# EAGLE design THAT-breakouts (EAGLE 7.5.0)
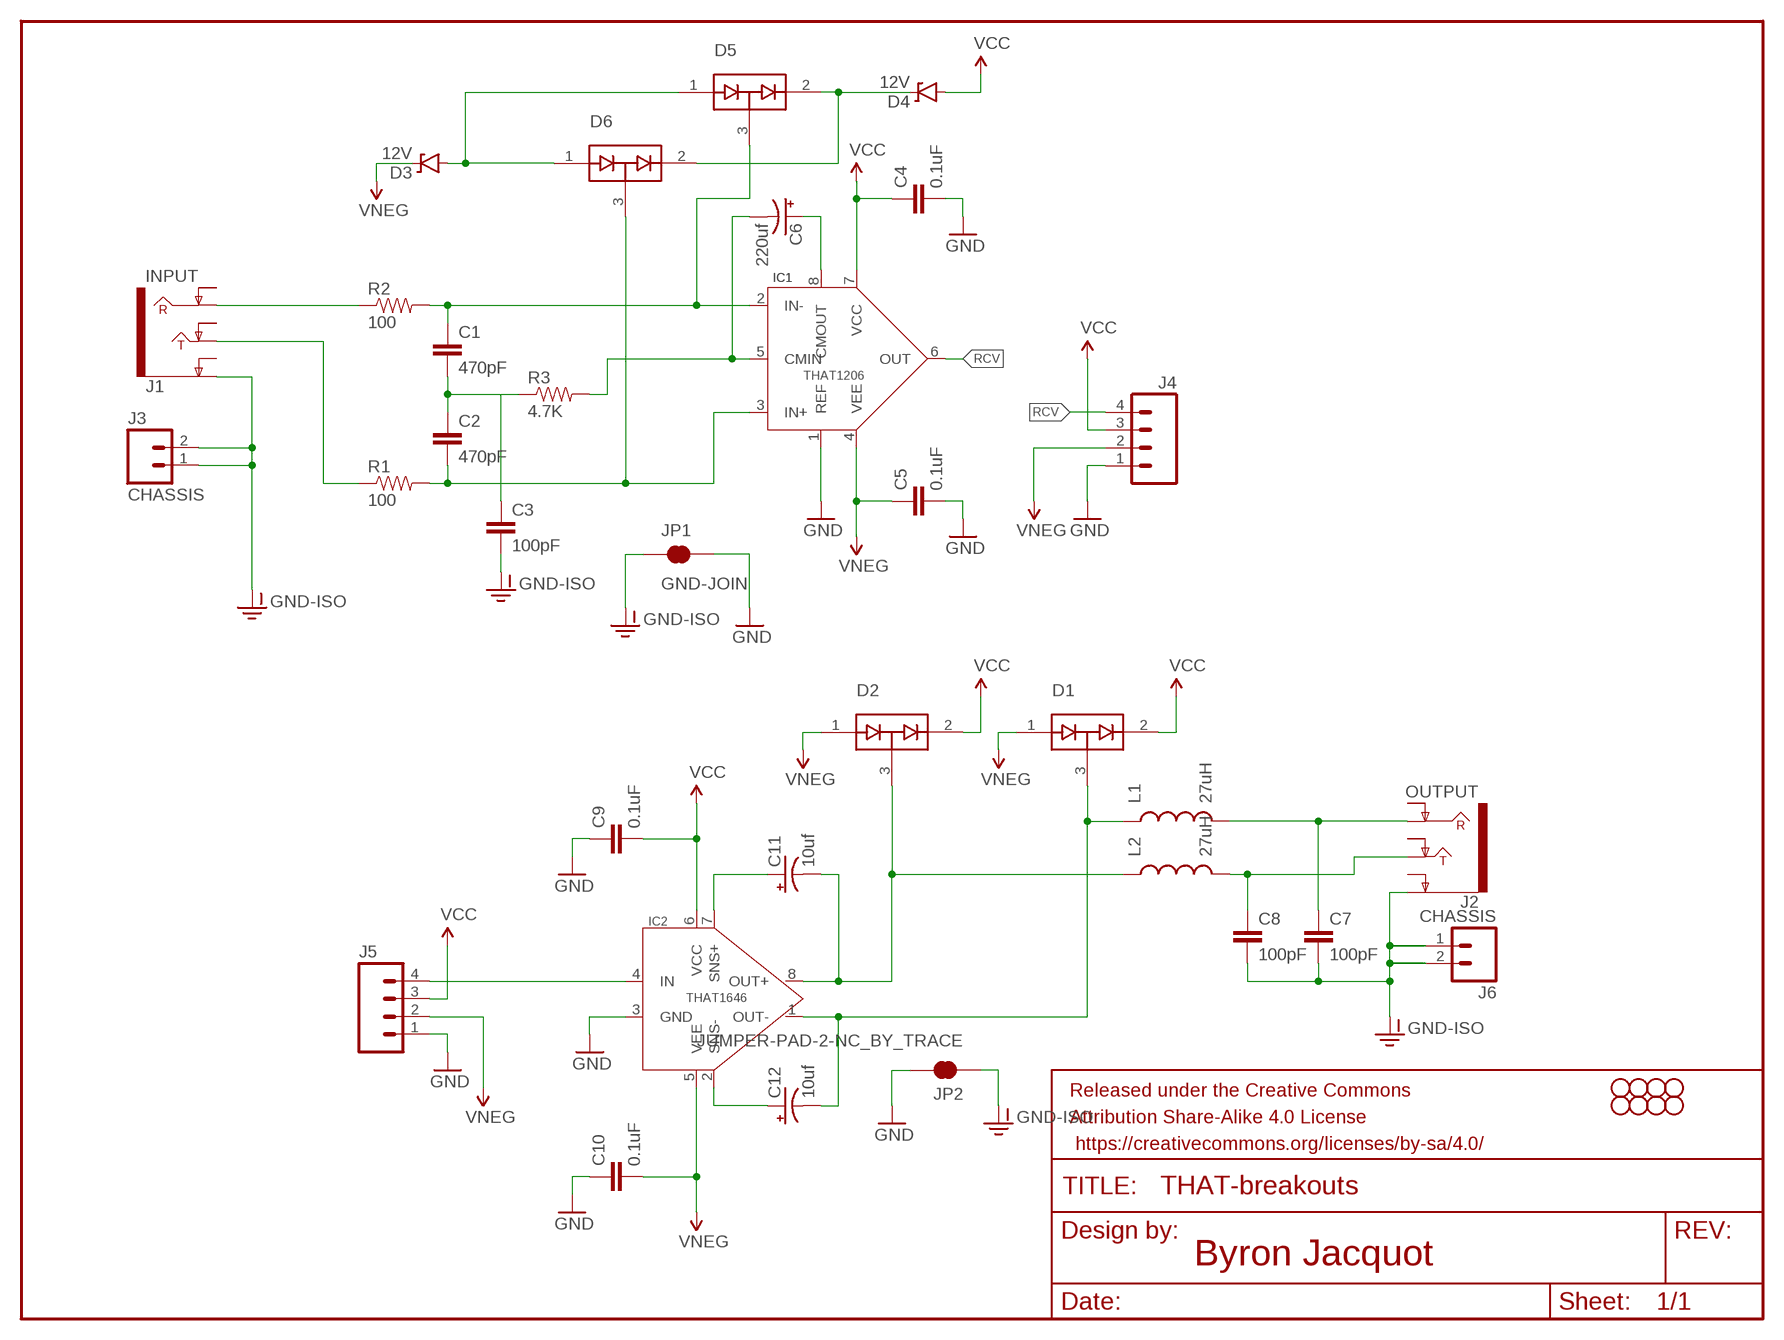
[diagram p0: schematic, sheet 1]

## Parts
C1  470pF  470PF-50V-5%(0603)SMD  [0603-CAP]
C2  470pF  470PF-50V-5%(0603)SMD  [0603-CAP]
C3  100pF  100PF-50V-5%(0603)  [0603-CAP]
C4  0.1uF  0.1UF-25V-5%(0603)  [0603-CAP]
C5  0.1uF  0.1UF-25V-5%(0603)  [0603-CAP]
C6  220uf  PANA-EEE-FKOJ221P  [PANASONIC_D]
C7  100pF  100PF-50V-5%(0603)  [0603-CAP]
C8  100pF  100PF-50V-5%(0603)  [0603-CAP]
C9  0.1uF  0.1UF-25V-5%(0603)  [0603-CAP]
C10  0.1uF  0.1UF-25V-5%(0603)  [0603-CAP]
C11  10uf  PANA-EEE-1EA100NP  [PANASONIC_D]
C12  10uf  PANA-EEE-1EA100NP  [PANASONIC_D]
D1  BAV99  [SOT23-3]
D2  BAV99  [SOT23-3]
D3  12V  12V-ZENER-DIODE  [SOD-323]
D4  12V  12V-ZENER-DIODE  [SOD-323]
D5  BAV99  [SOT23-3]
D6  BAV99  [SOT23-3]
FRAME1  FRAME-LETTER  [CREATIVE_COMMONS]
H1  STAND-OFF  [STAND-OFF]
H2  STAND-OFF  [STAND-OFF]
H3  STAND-OFF  [STAND-OFF]
H4  STAND-OFF  [STAND-OFF]
H5  STAND-OFF  [STAND-OFF]
H6  STAND-OFF  [STAND-OFF]
H7  STAND-OFF  [STAND-OFF]
H8  STAND-OFF  [STAND-OFF]
IC1  THAT1206  [SO08]
IC2  THAT1646  [SO08]
J1  INPUT  AUDIO-JACK4-.25-HORIZ-TRS  [AUDIO-JACK-.25-INCH-HORIZ-PTH]
J2  OUTPUT  AUDIO-JACK4-.25-HORIZ-TRS  [AUDIO-JACK-.25-INCH-HORIZ-PTH]
J3  CHASSIS  M021X02_NO_SILK  [1X02_NO_SILK]
J4  M04NO_SILK_ALL_ROUND  [1X04_NO_SILK_ALL_ROUND]
J5  M04NO_SILK_ALL_ROUND  [1X04_NO_SILK_ALL_ROUND]
J6  CHASSIS  M021X02_NO_SILK  [1X02_NO_SILK]
JP1  GND-JOIN  JUMPER-PAD-2-NC_BY_TRACE  [PAD-JUMPER-2-NC_BY_TRACE_YES_SILK]
JP2  JUMPER-PAD-2-NC_BY_TRACE  [PAD-JUMPER-2-NC_BY_TRACE_YES_SILK]
L1  27uH  INDUCTOR0603  [0603]
L2  27uH  INDUCTOR0603  [0603]
R1  100  100OHM-1/10W-1%(0603)  [0603-RES]
R2  100  100OHM-1/10W-1%(0603)  [0603-RES]
R3  4.7K  4.7KOHM-1/10W-1%(0603)  [0603-RES]

## Nets
GND: C4.2 C5.2 C9.1 C10.1 IC1.1(REF) IC2.3(GND) J4.1 J5.1 JP1.2 JP2.2
GND-ISO: C3.2 C7.2 C8.2 J1.SLEEVE(EARTH) J2.SLEEVE(EARTH) J3.1 J3.2 J6.1 J6.2 JP1.1 JP2.1
N$1: J1.RING R2.1
N$2: C1.1 D5.3(COM) IC1.2(IN-) R2.2
N$3: J1.TIP R1.1
N$4: C2.2 D6.3(COM) IC1.3(IN+) R1.2
N$5: C1.2 C2.1 C3.1 R3.1
N$6: C6.- IC1.5(CMIN) R3.2
N$7: C6.+ IC1.8(CMOUT)
N$8: C8.1 J2.TIP L2.2
N$9: C7.1 J2.RING L1.2
N$10: C11.- D2.3(COM) IC2.8(OUT+) L2.1
N$11: C12.- D1.3(COM) IC2.1(OUT-) L1.1
N$12: D3.A D5.1(A1) D6.1(A1)
N$13: C12.+ IC2.2(SNS-)
N$14: C11.+ IC2.7(SNS+)
N$15: D4.C D5.2(C2) D6.2(C2)
N$16: IC2.4(IN) J5.4
RCV: IC1.6(OUT) J4.4
VCC: C4.1 C9.2 D1.2(C2) D2.2(C2) D4.A IC1.7(VCC) IC2.6(VCC) J4.3 J5.3
VNEG: C5.1 C10.2 D1.1(A1) D2.1(A1) D3.C IC1.4(VEE) IC2.5(VEE) J4.2 J5.2
Unconnected: J1.RING-NORM J1.SLEEVE-NORM(EARTH-NORM) J1.TIP-NORM J2.RING-NORM J2.SLEEVE-NORM(EARTH-NORM) J2.TIP-NORM

## Notes on the sheet
- Byron Jacquot

## Library data of the parts
C1 C2 = SparkFun-Capacitors:470PF-50V-5%(0603): CAP-07884; PROD_ID: CAP-07884
C3 C7 C8 = SparkFun-Capacitors:100PF-50V-5%(0603): CAP-07883; PROD_ID: CAP-07883
C4 C5 C9 C10 = SparkFun-Capacitors:0.1UF-25V-5%(0603): CAP-08604; PROD_ID: CAP-08604
C6 = that-ics:PANA-EEE-FKOJ221P: 220 uF 6.3 V cap. Panasonic EEE-FK0J221P digikey PCE3766TR-ND
C11 C12 = that-ics:PANA-EEE-1EA100NP: Panasonic 10uf 25V nonpolar. Panasonic EEE-1EA100NP Digikey PCE4294TR-ND
D1 D2 D5 D6 = SparkFun-DiscreteSemi:BAV99: Two small signal silicon diodes connected anode to cathode. Connections to all three nodes available. DIO-10647; PROD_ID: DIO-10647
D3 D4 = that-ics:12V-ZENER-DIODE; DK_PN: MM3Z12VT1GOSCT-ND; MFR: ON Semi; MFR_PN: MM3Z12VT1G
FRAME1 = SparkFun-Aesthetics:FRAME-LETTER: Schematic Frame Standard 8.5x11 US Letter frame
H1-H8 = SparkFun-Electromechanical:STAND-OFF: #4 Stand Off This is the mechanical footprint for a #4 phillips button head screw. Use the keepout ring to avoid running the screw head into surrounding components. SKU : PRT-00447
IC1 = that-ics:THAT1206: THAT Corporation 1206 InGenius series balanced line receiver.
IC2 = that-ics:THAT1646: THAT Corporation 1646 OutSmarts Balanced line driver
J1 J2 = SparkFun-Connectors:AUDIO-JACK4-.25-HORIZ-TRS: 1/4" TRS jack, horizontal Production SKU: COM-11144 Footprint unproven - datasheet and part seem to be slightly different; PROD_ID: CONN-12339; SF_ID: COM-11144
J3 J6 = SparkFun-Connectors:M02: Standard 2-pin 0.1" header. Use with - straight break away headers ( PRT-00116) - right angle break away headers (PRT-00553) - swiss pins (PRT-00743) - machine pins (PRT-00117) - female headers (PRT-00115) Molex polarized connector foot print use with: PRT-08233 with associated crimp pins and housings. 2.54_SCREWTERM for use with PRT-10571. 3.5mm Screw Terminal footprints for PRT-08084 5mm Screw Terminal footprints for use with PRT-08432
J4 J5 = SparkFun-Connectors:M04: Header 4 Standard 4-pin 0.1" header. Use with straight break away headers (SKU : PRT-00116), right angle break away headers (PRT-00553), swiss pins (PRT-00743), machine pins (PRT-00117), and female headers (PRT-00115). Molex polarized connector foot print use with SKU : PRT-08231 with associated crimp pins and housings. 1MM SMD Version SKU: PRT-10208; PROD_ID: CONN-09696
JP1 JP2 = SparkFun-Passives:JUMPER-PAD-2-NC_BY_TRACE
L1 L2 = SparkFun-Passives:INDUCTOR: Inductors Basic Inductor/Choke - 0603 and 1206. Footprints are not proven and vary greatly between part numbers. INDUCTOR POWER 3.3UH 4.0A SMD 0.197" L x 0.197" W x 0.177" H (5.00mm x 5.00mm x 4.50mm)
R1 R2 = SparkFun-Resistors:100OHM-1/10W-1%(0603): RES-07863; PROD_ID: RES-07863
R3 = SparkFun-Resistors:4.7KOHM-1/10W-1%(0603): RES-07857; PROD_ID: RES-07857

## Board
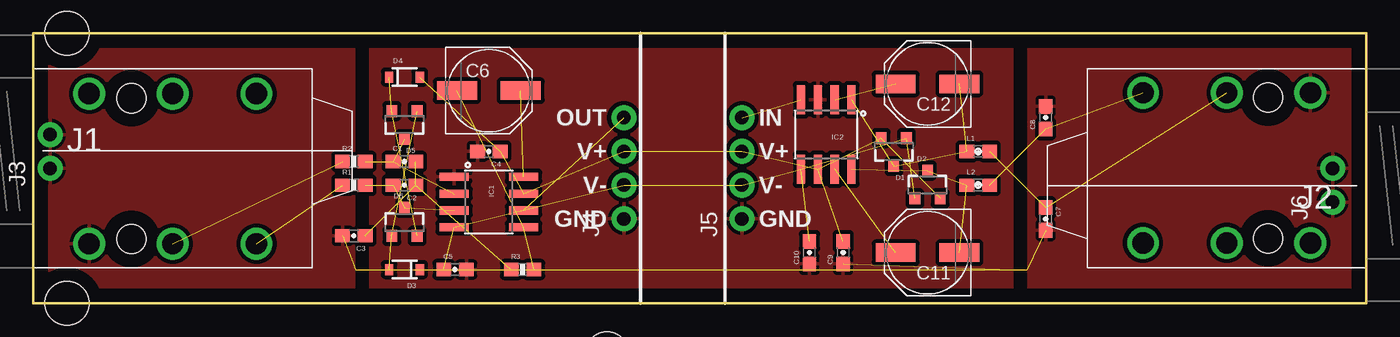
[diagram p1: board, top side]
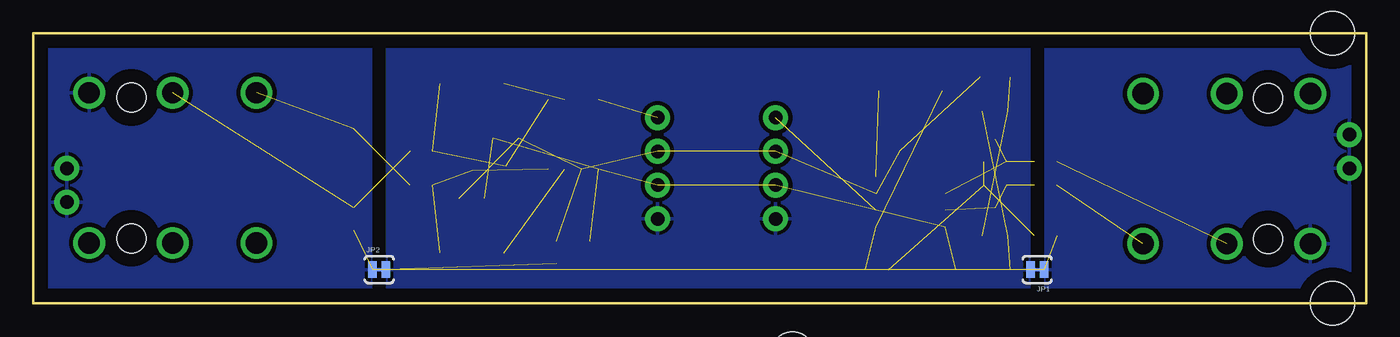
[diagram p2: board, bottom side, seen from below]

Size 100.33 x 20.32 mm. Coordinates in mm from the lower left corner, seen from the top.
Outline: 0,0 100.33,0 100.33,20.32 0,20.32 0,0
Copper layers (1*16): Top 0.035mm / dielectric 1.5mm / Bottom 0.035mm
Design rules "default": minimum track width 10mil, minimum drill 24mil, track to track 8mil, track to pad 8mil, pad to pad 8mil, via to via 8mil, smd to smd 8mil, copper to edge 40mil, drill to drill 8mil, minimum pad ring 10mil, minimum via ring 8mil, stop-mask expansion 4mil, vias tented up to drill 0mil, thermal gap 10mil

### Footprints (pad centres in the part's own frame; a part is rotated, then mirrored left to right if it is on the bottom)
0603-CAP = smd 1.1 x 1: 1 -0.85,0; 2 0.85,0
PANASONIC_D = smd 3 x 1.4: + 2.4,0; - -2.4,0
SOT23-3 = smd 0.8 x 0.9: 1 -0.95,-1; 2 0.95,-1; 3 0,1.1
SOD-323 = smd 0.63 x 0.83: A 1.15,0; C -1.15,0
STAND-OFF = hole 3.302: 0,0
SO08 = smd 0.61 x 2.21: 1 -1.905,-2.616; 2 -0.635,-2.616; 3 0.635,-2.616; 4 1.905,-2.616; 5 1.905,2.616; 6 0.635,2.616; 7 -0.635,2.616; 8 -1.905,2.616
AUDIO-JACK-.25-INCH-HORIZ-PTH = drill 1.6: RING 10.5,-6.95; RING-NORM 10.5,4.35; SLEEVE 4.2,-6.95; SLEEVE-NORM 4.2,4.35; TIP 16.8,-6.95; TIP-NORM 16.8,4.35 | hole 2.2: 7.4,4; 7.4,-6.6
1X02_NO_SILK = drill 1.016 pad 1.88: 1 0,0; 2 2.54,0
1X04_NO_SILK_ALL_ROUND = drill 1.016 pad 1.88: 1 0,0; 2 2.54,0; 3 5.08,0; 4 7.62,0
PAD-JUMPER-2-NC_BY_TRACE_YES_SILK = smd 0.635 x 1.27: 1 -0.508,0; 2 0.508,0
0603 = smd 1.1 x 1: 1 -0.85,0; 2 0.85,0
0603-RES = smd 1.1 x 1: 1 -0.85,0; 2 0.85,0

### Placement (x,y rotation side)
C1  27.94,10.67 0 top
C2  27.94,8.89 180 top
C3  24.13,5.08 180 top
C4  34.29,11.43 180 top
C5  31.75,2.54 0 top
C6  34.29,16 0 top
C7  76.2,6.35 270 top
C8  76.2,13.97 90 top
C9  60.96,3.81 90 top
C10  58.42,3.81 90 top
C11  67.31,3.81 180 top
C12  67.31,16.51 180 top
D1  64.77,11.43 180 top
D2  67.31,8.89 0 top
D3  27.94,2.54 180 top
D4  27.94,17.02 0 top
D5  27.94,13.46 180 top
D6  27.94,6.08 0 top
FRAME1  16.51,-20.32 0 top  (outside the outline)
H1  2.54,0 0 top
H2  40.64,26.67 0 top  (outside the outline)
H3  43.18,-3.81 0 top  (outside the outline)
H4  2.54,20.32 0 top
H5  -119.38,-52.07 0 top  (outside the outline)
H6  -119.38,-58.42 0 top  (outside the outline)
H7  -119.38,-64.77 0 top  (outside the outline)
H8  -119.38,-71.12 0 top  (outside the outline)
IC1  34.29,7.62 270 top
IC2  59.69,12.7 180 top
J1  0,11.43 0 top
J2  100.33,8.89 180 top
J3  1.27,10.16 90 top
J4  44.45,6.35 90 top
J5  53.34,6.35 90 top
J6  97.79,7.62 90 top
JP1  24.77,2.54 180 bottom
JP2  74.3,2.54 0 bottom
L1  71.12,11.43 0 top
L2  71.12,8.89 0 top
R1  24.13,8.89 0 top
R2  24.13,10.67 0 top
R3  36.83,2.54 0 top

### Tracks (layer width: path | path; a pad name or v marks a point on that pad's centre or on a via)
GND  (2 unrouted)
  pour Top (isolate 0.305): 73.66,22.86 73.66,0 25.4,0 25.4,22.86
  pour Bottom (isolate 0.305): 25.4,22.86 25.4,0 73.66,0 73.66,22.86
GND-ISO  (3 unrouted)
  pour Bottom (isolate 0.305): 0,22.86 24.13,22.86 24.13,0 0,0
  pour Top (isolate 0.305): 24.13,22.86 0,22.86 0,0 24.13,0
  pour Bottom (isolate 0.305): 74.93,0 74.93,22.86 100.33,22.86 100.33,0
  pour Top (isolate 0.305): 100.33,0 100.33,22.86 74.93,22.86 74.93,0
N$1  (1 unrouted)
N$2  (3 unrouted)
N$3  (1 unrouted)
N$4  (3 unrouted)
N$5  (3 unrouted)
N$6  (2 unrouted)
N$7  (1 unrouted)
N$8  (2 unrouted)
N$9  (2 unrouted)
N$10  (3 unrouted)
N$11  (3 unrouted)
N$12  (2 unrouted)
N$13  (1 unrouted)
N$14  (1 unrouted)
N$15  (2 unrouted)
N$16  (1 unrouted)
RCV  (1 unrouted)
VCC  (8 unrouted)
VNEG  (8 unrouted)

### Text on the board
tPlace: OUT | IN | V+ | V+ | V- | V- | GND | GND